# EAGLE design Paddidle_FrontPannel (EAGLE 6.4)
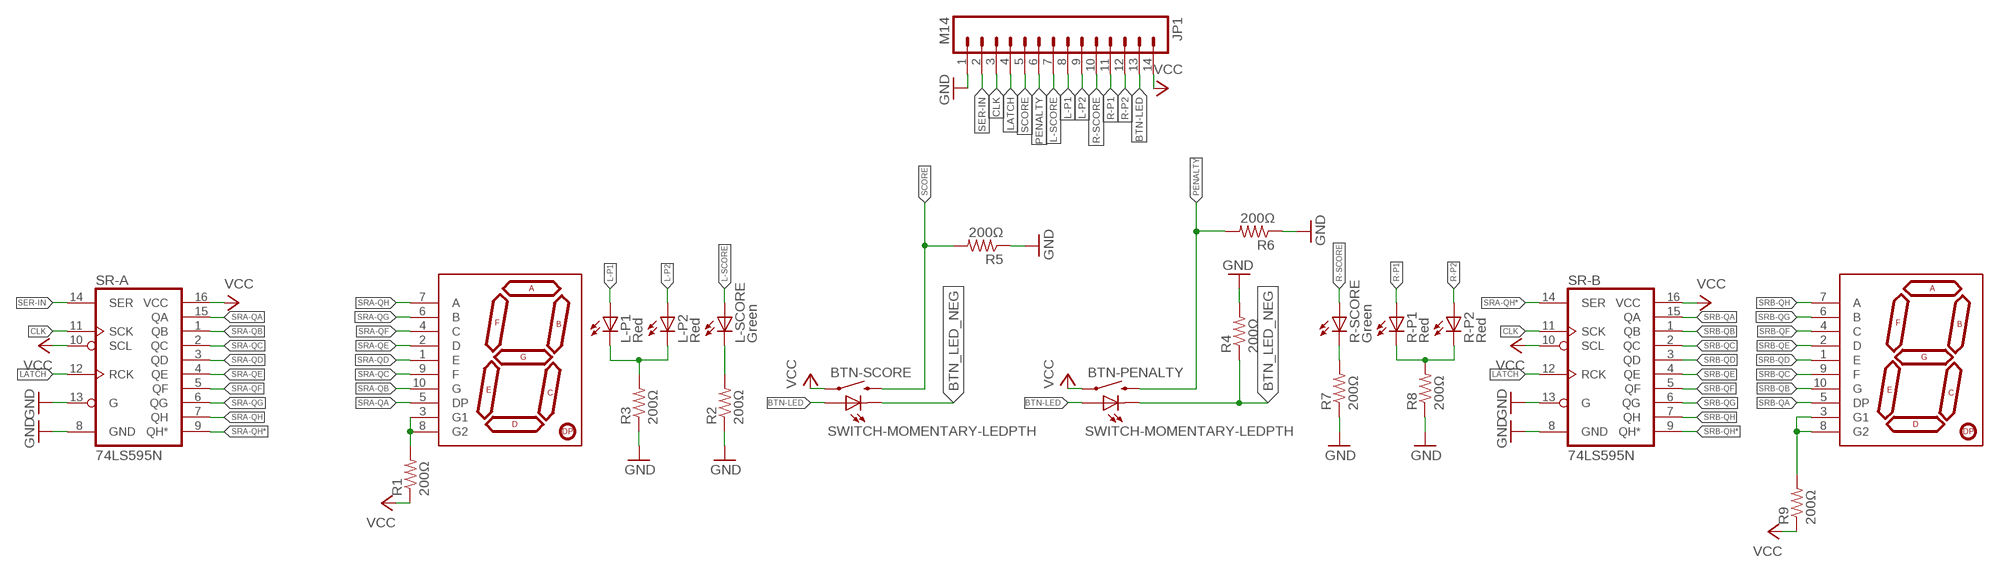
[diagram p0: schematic, sheet 1]

## Parts
7SEG-L  7-SEGMENT-DISPLAY-1"-RED  [7-SEGMENT-1"PTH]
7SEG-R  7-SEGMENT-DISPLAY-1"-RED  [7-SEGMENT-1"PTH]
BTN-PENALTY  SWITCH-MOMENTARY-LEDPTH  [TACTILE-PTH-LED-12MM]
BTN-SCORE  SWITCH-MOMENTARY-LEDPTH  [TACTILE-PTH-LED-12MM]
JP1  M14  [1X14]
L-P1  Red  LED5MM  [LED5MM]
L-P2  Red  LED5MM  [LED5MM]
L-SCORE  Green  LED5MM  [LED5MM]
R1  200Ω  R-US_R0805  [R0805]
R2  200Ω  R-US_R0805  [R0805]
R3  200Ω  R-US_R0805  [R0805]
R4  200Ω  R-US_R0805  [R0805]
R5  200Ω  R-US_R0805  [R0805]
R6  200Ω  R-US_R0805  [R0805]
R7  200Ω  R-US_R0805  [R0805]
R8  200Ω  R-US_R0805  [R0805]
R9  200Ω  R-US_R0805  [R0805]
R-P1  Red  LED5MM  [LED5MM]
R-P2  Red  LED5MM  [LED5MM]
R-SCORE  Green  LED5MM  [LED5MM]
SR-A  74LS595N  [DIL16]
SR-B  74LS595N  [DIL16]

## Nets
BTN-LED: BTN-PENALTY.A BTN-SCORE.A JP1.13
BTN_LED_NEG: BTN-PENALTY.C BTN-SCORE.C R4.1
CLK: JP1.3 SR-A.11(SCK) SR-B.11(SCK)
GND: JP1.1 R2.1 R3.1 R4.2 R5.1 R6.1 R7.1 R8.1 SR-A.8(GND) SR-A.13(G) SR-B.8(GND) SR-B.13(G)
L-P1: JP1.8 L-P1.A
L-P2: JP1.9 L-P2.A
L-SCORE: JP1.7 L-SCORE.A
LATCH: JP1.4 SR-A.12(RCK) SR-B.12(RCK)
N$1: L-P1.K(C) L-P2.K(C) R3.2
N$3: L-SCORE.K(C) R2.2
N$4: 7SEG-L.3(G1) 7SEG-L.8(G2) R1.2
N$5: R7.2 R-SCORE.K(C)
N$6: R8.2 R-P1.K(C) R-P2.K(C)
N$7: 7SEG-R.3(G1) 7SEG-R.8(G2) R9.2
PENALTY: BTN-PENALTY.2 JP1.6 R6.2
R-P1: JP1.11 R-P1.A
R-P2: JP1.12 R-P2.A
R-SCORE: JP1.10 R-SCORE.A
SCORE: BTN-SCORE.2 JP1.5 R5.2
SER-IN: JP1.2 SR-A.14(SER)
SRA-QA: 7SEG-L.5(DP) SR-A.15(QA)
SRA-QB: 7SEG-L.10(G) SR-A.1(QB)
SRA-QC: 7SEG-L.9(F) SR-A.2(QC)
SRA-QD: 7SEG-L.1(E) SR-A.3(QD)
SRA-QE: 7SEG-L.2(D) SR-A.4(QE)
SRA-QF: 7SEG-L.4(C) SR-A.5(QF)
SRA-QG: 7SEG-L.6(B) SR-A.6(QG)
SRA-QH: 7SEG-L.7(A) SR-A.7(QH)
SRA-QH*: SR-A.9(QH*) SR-B.14(SER)
SRB-QA: 7SEG-R.5(DP) SR-B.15(QA)
SRB-QB: 7SEG-R.10(G) SR-B.1(QB)
SRB-QC: 7SEG-R.9(F) SR-B.2(QC)
SRB-QD: 7SEG-R.1(E) SR-B.3(QD)
SRB-QE: 7SEG-R.2(D) SR-B.4(QE)
SRB-QF: 7SEG-R.4(C) SR-B.5(QF)
SRB-QG: 7SEG-R.6(B) SR-B.6(QG)
SRB-QH: 7SEG-R.7(A) SR-B.7(QH)
SRB-QH*: SR-B.9(QH*)
VCC: BTN-PENALTY.4 BTN-SCORE.4 JP1.14 R1.1 R9.1 SR-A.10(SCL) SR-A.16(VCC) SR-B.10(SCL) SR-B.16(VCC)

## Library data of the parts
7SEG-L 7SEG-R = SparkFun-Displays:7-SEGMENT-DISPLAY-1"-RED: 7-Segment Display 1" Red (COM-08546) EZ is for kits. Pads are only exposed on the bottom side to help prevent soldering in upside down.; OC_NEWARK: unknown
BTN-PENALTY BTN-SCORE = SparkFun-Electromechanical:SWITCH-MOMENTARY-LED: EZ is for Kits. There is no tStop (covering up the top side of the pads with mask). This helps the beginner see which side they should be soldering too.; OC_NEWARK: unknown
JP1 = SparkFun-Connectors:M14: Header 14 Standard 14-pin 0.1" header. Use with straight break away headers (SKU : PRT-00116), right angle break away headers (PRT-00553), swiss pins (PRT-00743), machine pins (PRT-00117), and female headers (PRT-00115).; OC_NEWARK: unknown
L-P1 L-P2 L-SCORE R-P1 R-P2 R-SCORE = adafruit:LED: LED OSRAM: - CHIPLED LG R971, LG N971, LY N971, LG Q971, LY Q971, LO R971, LY R971 LH N974, LH R974 LS Q976, LO Q976, LY Q976 LO Q996 - Hyper CHIPLED LW Q18S LB Q993, LB Q99A, LB R99A - SideLED LS A670, LO A670, LY A670, LG A670, LP A670 LB A673, LV A673, LT A673, LW A673 LH A674 LY A675 LS A676, LA A676, LO A676, LY A676, LW A676 LS A679, LY A679, LG A679 - Hyper Micro SIDELED® LS Y876, LA Y876, LO Y876, LY Y876 LT Y87S - SmartLED LW L88C, LW L88S LB L89C, LB L89S, LG L890 LS L89K, LO L89K, LY L89K LS L896, LA L896, LO L896, LY L896 - TOPLED LS T670, LO T670, LY T670, LG T670, LP T670 LSG T670, LSP T670, LSY T670, LOP T670, LYG T670 LG T671, LOG T671, LSG T671 LB T673, LV T673, LT T673, LW T673 LH T674 LS T676, LA T676, LO T676, LY T676, LB T676, LH T676, LSB T676, LW T676 LB T67C, LV T67C, LT T67C, LS T67K, LO T67K, LY T67K, LW E67C LS E67B, LA E67B, LO E67B, LY E67B, LB E67C, LV E67C, LT E67C LW T67C LS T679, LY T679, LG T679 LS T770, LO T770, LY T770, LG T770, LP T770 LB T773, LV T773, LT T773, LW T773 LH T774 LS E675, LA E675, LY E675, LS T675 LS T776, LA T776, LO T776, LY T776, LB T776 LHGB T686 LT T68C, LB T68C - Hyper Mini TOPLED® LB M676 - Mini TOPLED Santana® LG M470 LS M47K, LO M47K, LY M47K Source: http://www.osram.convergy.de/; OC_NEWARK: unknown
R1-R9 = adafruit:R-US_: RESISTOR, American symbol; MPN: PFC-W0805LF-03-2000-B; OC_NEWARK: 11M7214
SR-A SR-B = SparkFun-DigitalIC:74*595: 8-bit SHIFT REGISTER, output latch; MF: TEXAS INSTRUMENTS; MPN: SN74LS595N; OC_NEWARK: 67K1099

## Net classes
0 default: width 0.305 mm, drill 0.381 mm, clearance 0.406 mm

## Board
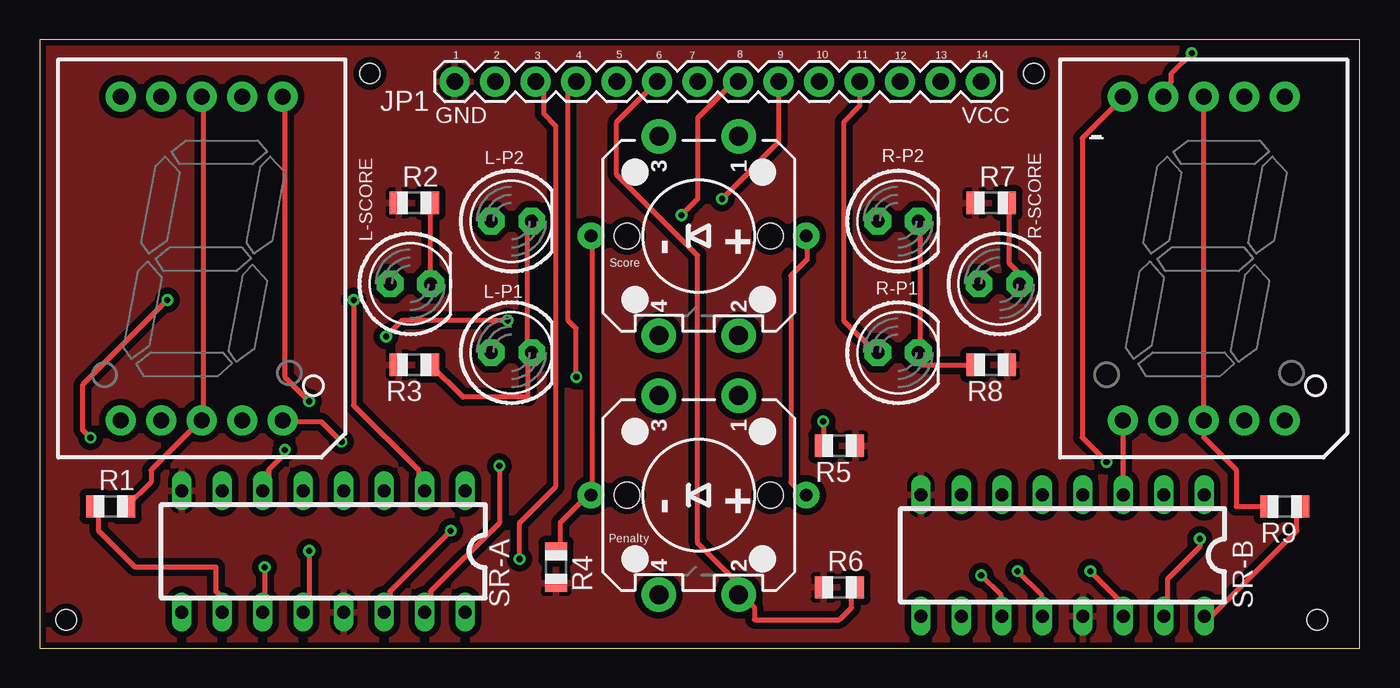
[diagram p1: board, top side]
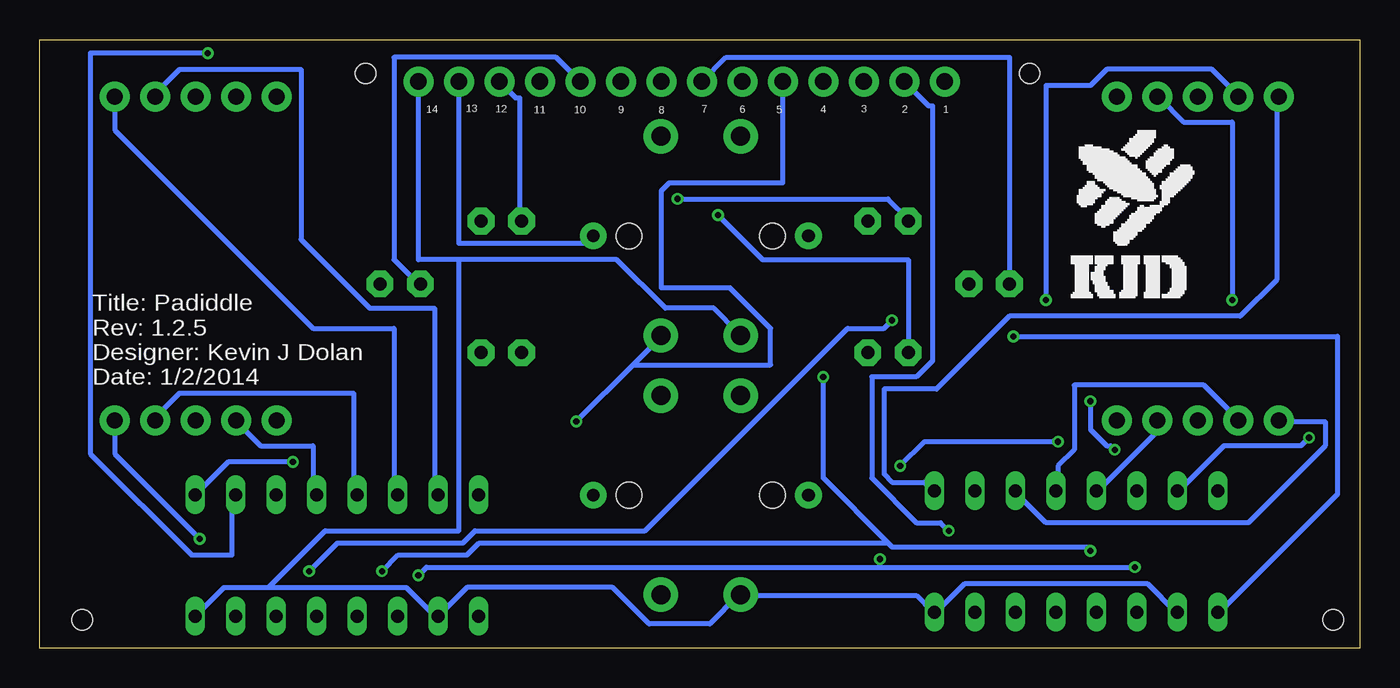
[diagram p2: board, bottom side, seen from below]

Size 82.8 x 38.18 mm. Coordinates in mm from the lower left corner, seen from the top.
Outline: 0,0 82.8,0 82.8,38.18 0,38.18 0,0
Copper layers (1*16): Top 0.0356mm / dielectric 1.5011mm / Bottom 0.0356mm
Design rules "OSH": minimum track width 6mil, minimum drill 13mil, track to track 6mil, track to pad 6mil, pad to pad 6mil, via to via 6mil, smd to smd 6mil, copper to edge 15mil, drill to drill 6mil, minimum pad ring 7mil, minimum via ring 7mil, stop-mask expansion 3mil, vias tented up to drill 0mil, thermal gap 10mil
Holes 1.27 mm at 62.36,36.07 20.7,36.07 1.65,1.78 80.14,1.78

### Footprints (pad centres in the part's own frame; a part is rotated, then mirrored left to right if it is on the bottom)
7-SEGMENT-1"PTH = drill 1 pad 1.88: 1 -5.08,-10.16; 2 -2.54,-10.16; 3 0,-10.16; 4 2.54,-10.16; 5 5.08,-10.16; 6 5.08,10.16; 7 2.54,10.16; 8 0,10.16; 9 -2.54,10.16; 10 -5.08,10.16
TACTILE-PTH-LED-12MM = drill 1.2 pad 2.159: 1 -6.25,2.5; 2 6.25,2.5; 3 -6.25,-2.5; 4 6.25,-2.5 | drill 0.8 pad 1.676: A 0,6.75; C 0,-6.75 | hole 1.6: 0,4.5; 0,-4.5
1X14 = drill 1.016 pad 1.88: 1 0,0; 2 2.54,0; 3 5.08,0; 4 7.62,0; 5 10.16,0; 6 12.7,0; 7 15.24,0; 8 17.78,0; 9 20.32,0; 10 22.86,0; 11 25.4,0; 12 27.94,0; 13 30.48,0; 14 33.02,0
LED5MM = drill 0.813 pad 1.676 octagon: A -1.27,0; K 1.27,0
R0805 = smd 1.1 x 1.4: 1 -1,0; 2 1,0
DIL16 = drill 0.813 long: 1 -8.89,-3.81; 2 -6.35,-3.81; 3 -3.81,-3.81; 4 -1.27,-3.81; 5 1.27,-3.81; 6 3.81,-3.81; 7 6.35,-3.81; 8 8.89,-3.81; 9 8.89,3.81; 10 6.35,3.81; 11 3.81,3.81; 12 1.27,3.81; 13 -1.27,3.81; 14 -3.81,3.81; 15 -6.35,3.81; 16 -8.89,3.81

### Placement (x,y rotation side)
7SEG-L  10.16,24.46 0 top
7SEG-R  73.03,24.46 0 top
BTN-PENALTY  41.34,9.6 270 top
BTN-SCORE  41.34,25.87 270 top
JP1  26.04,35.56 0 top
L-P1  29.59,18.54 0 top
L-P2  29.59,26.8 0 top
L-SCORE  23.24,22.86 0 top
R1  4.45,8.89 0 top
R2  23.5,27.94 0 top
R3  23.5,17.78 0 top
R4  32.38,5.08 270 top
R5  50.16,12.7 180 top
R6  50.16,3.81 0 top
R7  59.69,27.94 0 top
R8  59.69,17.78 180 top
R9  78.11,8.89 180 top
R-P1  53.85,18.54 0 top
R-P2  53.85,26.8 0 top
R-SCORE  60.2,22.86 0 top
SR-A  17.78,6.07 180 top
SR-B  64.16,5.82 180 top

### Tracks (layer width: path | path; a pad name or v marks a point on that pad's centre or on a via)
BTN-LED
  Top 0.305: BTN-PENALTY.A 47.88,9.65 47.12,10.41 47.12,23.37 48.13,24.38 48.13,25.65 BTN-SCORE.A
  Bottom 0.305: JP1.13 56.52,25.4 48.39,25.4 48.13,25.65 BTN-SCORE.A
BTN_LED_NEG
  Top 0.305: R4.1 32.38,6.1 32.64,6.35 32.64,7.87 34.42,9.65 BTN-PENALTY.C 34.67,9.65 34.67,25.65 BTN-SCORE.C
CLK  (via drill 0.38)
  Top 0.305: v14.1,5.08 14.1,2.29 SR-A.11 | v59.05,4.57 60.32,3.3 60.32,2.03 SR-B.11 | JP1.3 31.62,35.05 31.62,33.53 32.38,32.77 32.38,10.16 30.1,7.87 v30.1,5.59
  Bottom 0.305: 30.1,5.08 58.55,5.08 v59.05,4.57 | 30.1,5.08 v14.1,5.08 | 30.1,5.08 v30.1,5.59
GND
  pour Top: -8.81,39.45 -8.81,-1.19 89.36,-1.42 89.36,39.22
L-P1  (via drill 0.38)
  Top 0.305: v40.26,27.18 41.27,28.19 41.27,33.27 43.56,35.56 JP1.8
  Bottom 0.305: L-P1.A 28.32,24.38 37.46,24.38 v40.26,27.18
L-P2  (via drill 0.38)
  Top 0.305: v42.8,28.19 46.35,31.75 JP1.9
  Bottom 0.305: v42.8,28.19 29.59,28.19 28.32,26.92 L-P2.A
L-SCORE
  Bottom 0.305: L-SCORE.A 21.97,37.08 39.75,37.08 JP1.7
LATCH  (via drill 0.38)
  Top 0.305: v16.89,6.1 16.89,2.54 16.64,2.29 SR-A.12 | v61.34,4.83 62.86,3.3 62.86,2.03 SR-B.12 | JP1.4 33.15,35.05 33.15,20.57 33.65,20.07 v33.65,17.02
  Bottom 0.305: v16.89,6.1 17.14,6.35 29.34,6.35 29.59,6.6 | 29.59,6.6 55.24,6.6 56.01,5.84 60.32,5.84 v61.34,4.83 | v33.65,17.02 33.65,10.67 29.59,6.6
N$1
  Top 0.305: 30.61,18.29 30.61,15.75 26.54,15.75 24.51,17.78 R3.2 | 30.61,18.29 30.61,26.42 30.86,26.67 L-P2.K | 30.61,18.29 L-P1.K
N$3
  Top 0.305: L-SCORE.K 24.51,27.94 R2.2
N$4
  Top 0.305: R1.2 5.46,8.89 6.99,10.41 6.99,11.18 10.03,14.22 7SEG-L.3 10.29,14.48 10.29,34.54 7SEG-L.8
N$5
  Top 0.305: R7.2 60.83,27.94 60.83,24.13 61.59,23.37 61.59,22.86 R-SCORE.K
N$6
  Top 0.305: R8.2 55.24,17.78 55.24,18.54 | 55.24,18.54 55.24,26.67 R-P2.K | 55.24,18.54 R-P1.K
N$7
  Top 0.305: R9.2 75.06,8.89 75.06,11.18 73.03,13.21 7SEG-R.3 7SEG-R.8
PENALTY
  Top 0.305: R6.2 50.93,3.81 50.93,2.54 50.16,1.78 44.83,1.78 44.83,2.54 44.07,3.3 BTN-PENALTY.2 43.81,3.56 43.81,4.06 41.27,6.6 41.27,24.64 36.2,29.72 36.2,33.02 JP1.6
R-P1
  Top 0.305: JP1.11 51.43,34.04 50.42,33.02 50.42,20.57 52.45,18.54 R-P1.A
R-P2
  Bottom 0.305: JP1.12 52.96,34.54 52.7,34.54 52.7,26.92 R-P2.A
R-SCORE
  Bottom 0.305: JP1.10 50.42,37.08 60.58,37.08 60.58,24.38 59.05,22.86 R-SCORE.A
SCORE  (via drill 0.38)
  Top 0.305: v49.15,14.22 49.15,12.7 R5.2
  Bottom 0.305: 45.59,17.78 43.81,19.56 BTN-SCORE.2 | 45.59,17.78 v49.15,14.22 | JP1.5 36.2,29.21 43.31,29.21 43.81,28.7 43.81,22.61 39.5,22.61 36.96,20.07 36.96,17.78 45.59,17.78
SER-IN  (via drill 0.38)
  Top 0.305: v25.78,7.37 21.97,3.56 21.97,2.54 21.72,2.29 SR-A.14
  Bottom 0.305: v25.78,7.37 26.29,7.87 27.81,7.87 30.61,10.67 30.61,17.02 27.81,17.02 26.8,18.03 26.8,34.04 27.05,34.04 JP1.2
SRA-QA  (via drill 0.38)
  Top 0.305: v28.83,11.43 28.83,7.87 24.51,3.56 24.51,2.54 24.26,2.29 SR-A.15 | v18.92,12.95 17.65,14.22 15.37,14.22 7SEG-L.5
  Bottom 0.305: v28.83,11.43 27.3,12.95 v18.92,12.95
SRA-QB
  Bottom 0.305: SR-A.1 26.8,9.91 27.3,10.41 29.34,10.41 29.85,10.92 29.85,16.26 26.54,16.26 21.97,20.83 7.49,20.83 5.21,23.11 5.21,34.54 7SEG-L.10
SRA-QC  (via drill 0.38)
  Top 0.305: v19.69,21.84 19.69,15.24 23.75,11.18 23.75,10.16 24,9.91 SR-A.2
  Bottom 0.305: v19.69,21.84 19.69,35.31 16.89,35.31 15.87,36.32 9.27,36.32 7.75,34.8 7SEG-L.9
SRA-QD
  Bottom 0.305: SR-A.3 21.46,9.65 19.69,7.87 6.99,7.87 2.16,12.7 2.16,14.22 4.95,14.22 7SEG-L.1
SRA-QE
  Bottom 0.305: SR-A.4 18.92,9.91 18.92,11.43 17.91,12.45 17.91,16.51 9.78,16.51 7.75,14.48 7SEG-L.2
SRA-QF
  Bottom 0.305: SR-A.5 16.38,9.91 12.83,13.46 12.83,14.22 7SEG-L.4
SRA-QG  (via drill 0.38)
  Top 0.305: v15.37,12.45 15.37,12.19 14.35,11.18 14.35,10.16 14.1,9.91 SR-A.6 | v16.89,15.49 15.37,17.02 15.37,34.54 7SEG-L.6
  Bottom 0.305: v15.37,12.45 15.62,12.7 15.87,12.7 16.89,13.72 v16.89,15.49
SRA-QH  (via drill 0.38)
  Top 0.305: v3.17,13.21 2.67,13.72 2.67,16.51 v8,21.84
  Bottom 0.305: v3.17,13.21 3.68,12.7 8.51,12.7 11.3,9.91 SR-A.7 | v8,21.84 8,33.02 11.05,33.02 12.57,34.54 7SEG-L.7
SRA-QH*  (via drill 0.38)
  Top 0.305: v21.72,19.56 22.73,20.57 v29.34,20.57 | v65.91,4.83 67.95,2.79 67.95,2.03 SR-B.14
  Bottom 0.305: v21.72,19.56 1.4,19.56 1.4,9.65 8.76,2.29 SR-A.9 | v29.34,20.57 29.85,20.07 32.13,20.07 44.83,7.37 55.5,7.37 56.26,6.6 64.14,6.6 v65.91,4.83
SRB-QA  (via drill 0.38)
  Top 0.305: v72.77,6.86 72.77,6.35 70.74,4.32 70.74,2.03 SR-B.15
  Bottom 0.305: v72.77,6.86 78.11,12.19 7SEG-R.5
SRB-QB  (via drill 0.38)
  Top 0.305: v66.93,11.68 65.41,13.21 65.41,32 67.95,34.54 7SEG-R.10
  Bottom 0.305: SR-B.1 70.99,11.68 v66.93,11.68
SRB-QC  (via drill 0.38)
  Top 0.305: v72.26,37.34 70.99,36.07 70.99,35.56 70.48,35.05 7SEG-R.9
  Bottom 0.305: v72.26,37.34 79.63,37.34 79.63,12.19 73.28,5.84 70.74,5.84 70.74,9.4 SR-B.2
SRB-QD
  Top 0.305: 7SEG-R.1 67.95,9.65 SR-B.3
SRB-QE
  Bottom 0.305: SR-B.4 65.66,9.65 65.66,12.7 68.96,12.7 70.48,14.22 7SEG-R.2
SRB-QF
  Bottom 0.305: SR-B.5 63.12,9.65 63.12,16 74.04,16 75.56,14.48 7SEG-R.4
SRB-QG
  Bottom 0.305: 7SEG-R.6 78.11,32.51 65.66,20.07 60.58,20.07 60.58,9.65 SR-B.6
SRB-QH
  Bottom 0.305: SR-B.7 58.04,9.65 58.04,21.34 62.1,21.34 66.42,25.65 66.42,36.32 74.04,36.32 75.56,34.8 7SEG-R.7
VCC
  Top 0.305: R9.1 78.87,8.89 78.87,7.37 73.28,1.78 SR-B.16 | R1.1 3.68,8.89 3.68,7.37 5.97,5.08 11.05,5.08 11.05,3.56 11.3,3.3 11.3,2.29 SR-A.10
  Bottom 0.305: JP1.14 59.05,24.38 56.52,24.38 | 56.52,24.38 46.61,24.38 43.56,21.34 40.51,21.34 38.99,19.81 BTN-SCORE.4 | 68.45,3.81 71.25,3.81 SR-B.16 | 68.45,3.81 59.82,3.81 58.04,2.03 SR-B.10 56.01,3.81 46.86,3.81 44.58,1.52 40.77,1.52 38.99,3.3 BTN-PENALTY.4 38.73,3.3 27.81,3.3 26.8,2.29 SR-A.16 26.54,2.29 24.77,4.06 13.33,4.06 11.56,2.29 SR-A.10 | 56.52,24.38 56.52,7.37 64.9,7.37 68.45,3.81

### Text on the board
tPlace: 1 | 2 | 3 | 4 | 5 | 6 | 7 | 8 | 9 | 10 | 11 | 12 | 13 | 14 | Score | Penalty
bPlace: 1 | 2 | 3 | 4 | 5 | 6 | 7 | 8 | 9 | 10 | 11 | 12 | 13 | 14
tNames: GND | VCC
bNames: Title: Padiddle / Rev: 1.2.5 / Designer: Kevin J Dolan / Date: 1/2/2014